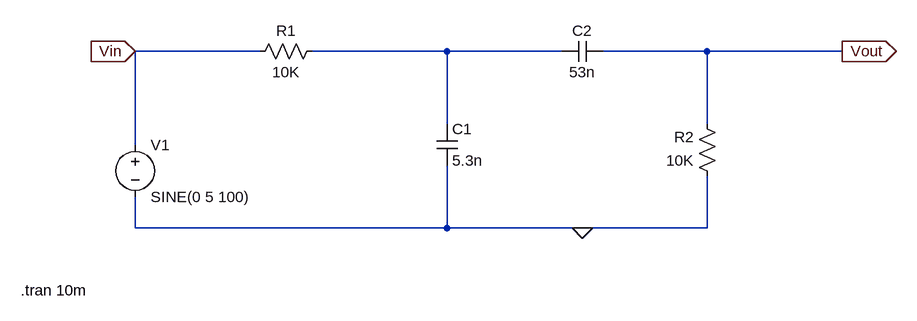
[diagram p0: schematic lab06-part1.asc]
lab06-part1.asc, the LTspice schematic file:
Version 4
SHEET 1 1076 680
WIRE 80 208 -112 208
WIRE 368 208 160 208
WIRE 544 208 368 208
WIRE 768 208 608 208
WIRE 976 208 768 208
WIRE 368 320 368 208
WIRE 768 320 768 208
WIRE -112 352 -112 208
WIRE -112 480 -112 432
WIRE 368 480 368 384
WIRE 368 480 -112 480
WIRE 576 480 368 480
WIRE 768 480 768 400
WIRE 768 480 576 480
FLAG 576 480 0
FLAG 976 208 Vout
IOPIN 976 208 Out
FLAG -112 208 Vin
IOPIN -112 208 In
SYMBOL voltage -112 336 R0
SYMATTR InstName V1
SYMATTR Value SINE(0 5 100)
SYMBOL res 176 192 R90
WINDOW 0 0 56 VBottom 2
WINDOW 3 32 56 VTop 2
SYMATTR InstName R1
SYMATTR Value 10K
SYMBOL res 784 416 R180
WINDOW 0 36 76 Left 2
WINDOW 3 36 40 Left 2
SYMATTR InstName R2
SYMATTR Value 10K
SYMBOL cap 352 320 R0
SYMATTR InstName C1
SYMATTR Value 5.3n
SYMBOL cap 608 192 R90
WINDOW 0 0 32 VBottom 2
WINDOW 3 32 32 VTop 2
SYMATTR InstName C2
SYMATTR Value 53n
TEXT -288 576 Left 2 !.tran 10m

The netlist it stands for:
* lab06-part1.asc
V1 Vin 0 SINE(0 5 100)
R1 N001 Vin 10K
R2 0 Vout 10K
C1 N001 0 5.3n
C2 Vout N001 53n
.tran 10m
.backanno
.end

* Results of the author's LTspice run, read from the files saved beside the schematic
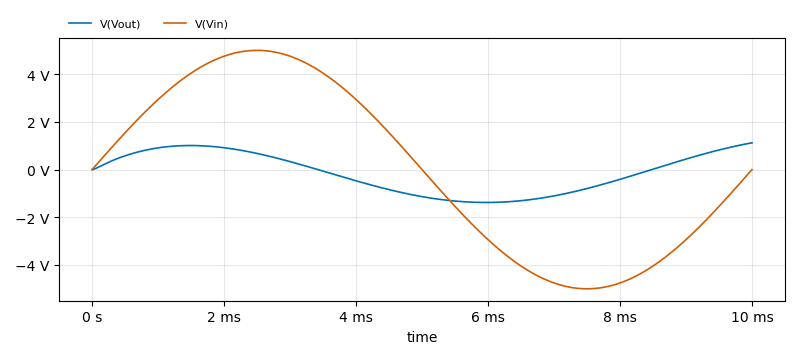
[diagram p1: Transient Analysis of lab06-part1.asc, plotted from the saved traces]
* Transient Analysis, 1 run:
*   V(Vout): min -1.379 V, max 1.122 V, average -126.3 mV, rms 855.3 mV, last 1.122 V
*   V(Vin): min -5 V, max 5 V, average 0 V, rms 3.536 V, last 0 V